# EAGLE design VoltageReferenceProgrammableLTC6655RevDX314 (EAGLE 7.7.0)
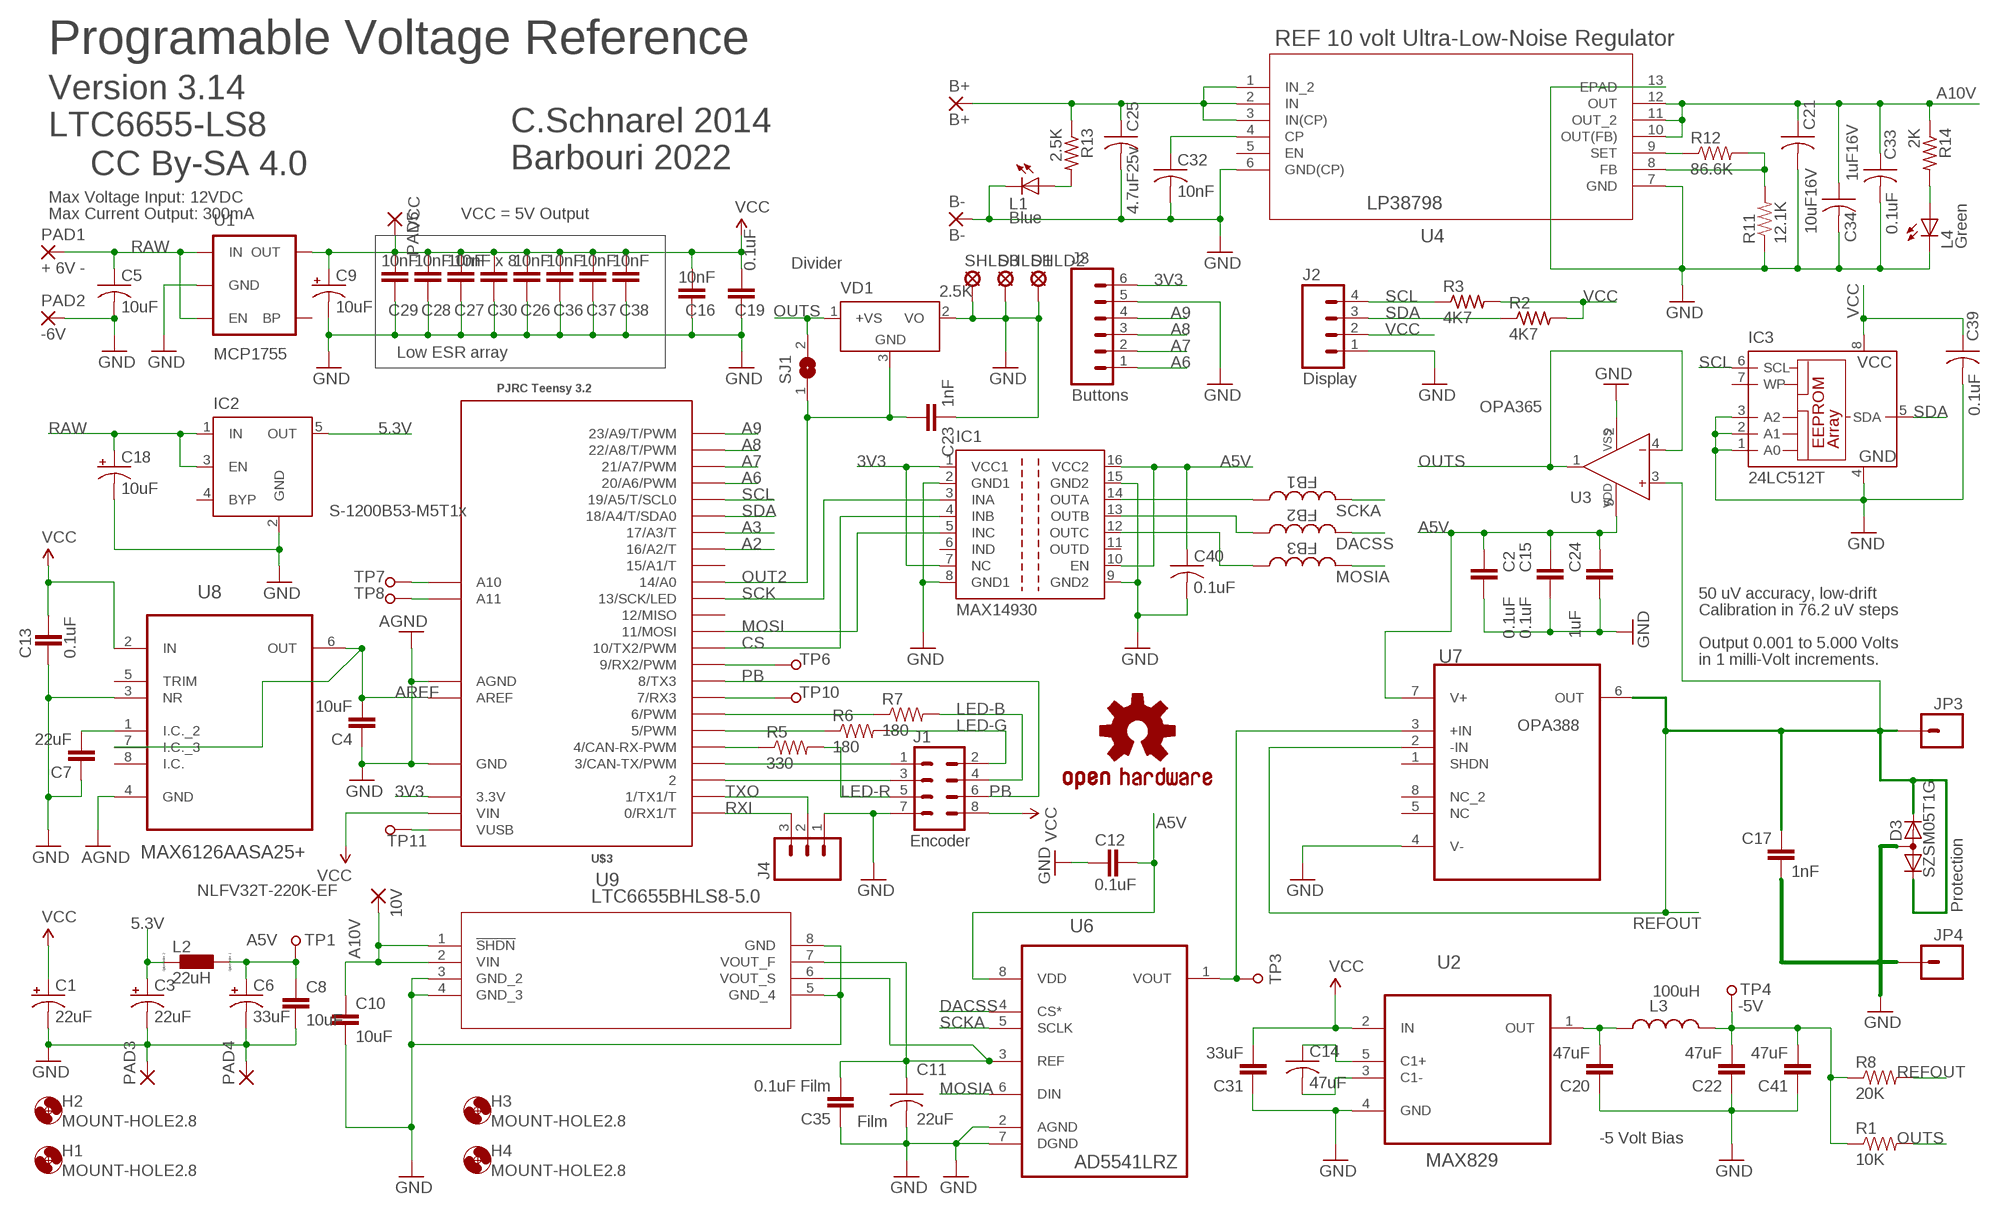
[diagram p0: schematic, sheet 1]

## Parts
10V  1,6/0,9  [1,6/0,9]
B+  B+  1,6/0,9  [1,6/0,9]
B-  B-  1,6/0,9  [1,6/0,9]
C1  22uF  CAP_POL0805  [0805-POL]
C2  0.1uF  CAP0805  [0805]
C3  22uF  CAP_POL0805  [0805-POL]
C4  10uF  CAP0805  [0805]
C5  10uF  C-USC1206K  [C1206K]
C6  33uF  CAP_POL0805  [0805-POL]
C7  22uF  CAP0805  [0805]
C8  10uF  CAP0805  [0805]
C9  10uF  CAP_POL0805  [0805-POL]
C10  10uF  CAP0805  [0805]
C11  22uF  C-USC2220K  [C2220K]
C12  0.1uF  CAP0805  [0805]
C13  0.1uF  CAP0805  [0805]
C14  47uF  C-USC0805  [C0805]
C15  0.1uF  CAP0805  [0805]
C16  10nF  C-EUC0603K  [C0603K]
C17  1nF  CAP0805  [0805]
C18  10uF  CAP_POL0805  [0805-POL]
C19  0.1uF  CAP0805  [0805]
C20  47uF  CAP0805  [0805]
C21  10uF16V  C-USC1206  [C1206]
C22  47uF  CAP1206  [1206]
C23  1nF  CAP0805  [0805]
C24  1uF  CAP0805  [0805]
C25  4.7uF25v  C-USC1206  [C1206]
C26  10nF  C-EUC0603K  [C0603K]
C27  10nF  C-EUC0603K  [C0603K]
C28  10nF  C-EUC0603K  [C0603K]
C29  10nF  C-EUC0603K  [C0603K]
C30  10nF x 8  C-EUC0603K  [C0603K]
C31  33uF  CAP0805  [0805]
C32  10nF  C-USC0805  [C0805]
C33  0.1uF  C-USC0603  [C0603]
C34  1uF16V  C-USC1206  [C1206]
C35  0.1uF Film  CAP0805  [0805]
C36  10nF  C-EUC0603K  [C0603K]
C37  10nF  C-EUC0603K  [C0603K]
C38  10nF  C-EUC0603K  [C0603K]
C39  0.1uF  C-USC0805  [C0805]
C40  0.1uF  C-USC0603  [C0603]
C41  47uF  CAP1206  [1206]
D3  SZSM05T1G  DIODE_CA-AC__  [SOT23C]
FB1  1K  WE-CBA_0402_782422102_WB/HS  [WE-CBA_0402(W=1.5)]
FB2  1K  WE-CBA_0402_782422102_WB/HS  [WE-CBA_0402(W=1.5)]
FB3  1K  WE-CBA_0402_782422102_WB/HS  [WE-CBA_0402(W=1.5)]
H1  MOUNT-HOLE2.8  [2,8]
H2  MOUNT-HOLE2.8  [2,8]
H3  MOUNT-HOLE2.8  [2,8]
H4  MOUNT-HOLE2.8  [2,8]
IC1  MAX14930  ISO7240  [SO-16DW]
IC2  S-1200B53-M5T1x  MIC5219XX  [SOT23-5]
IC3  24LC512T  24LC64SN  [SO-08]
J1  Encoder  M04X2  [2X4]
J2  Display  M04LOCK  [1X04_LOCK]
J3  Buttons  M06LOCK  [1X06_LOCK]
J4  M03LOCK  [1X03_LOCK]
JP3  M01PTH  [1X01]
JP4  M01PTH  [1X01]
L1  Blue  LEDCHIP-LED0603  [CHIP-LED0603]
L2  22uH  LL3225P  [L3225P]
L3  100uH  INDUCTOR0805-IND  [0805]
L4  Green  LEDCHIP-LED0603  [CHIP-LED0603]
LOGO1  OSHW-LOGOM  [OSHW-LOGO-M]
PAD1  + 6V -  2,15/1,0  [2,15/1,0]
PAD2  -6V  2,15/1,0  [2,15/1,0]
PAD3  1,6/0,9  [1,6/0,9]
PAD4  1,6/0,9  [1,6/0,9]
PAD5  1,6/0,9  [1,6/0,9]
R1  10K  RESISTOR0805-RES  [0805]
R2  4K7  R-US_R0603  [R0603]
R3  4K7  R-US_R0603  [R0603]
R5  330  RESISTOR0805-RES  [0805]
R6  180  RESISTOR0805-RES  [0805]
R7  180  RESISTOR0805-RES  [0805]
R8  20K  RESISTOR0805-RES  [0805]
R11  12.1K  RESISTOR0805-RES  [0805]
R12  86.6K  RESISTOR0805-RES  [0805]
R13  2.5K  R-US_R0603  [R0603]
R14  2K  R-US_R0603  [R0603]
SHLD1  SHLD1  LSP11  [LSP11]
SHLD2  SHLD2  LSP11  [LSP11]
SHLD3  SHLD1  LSP11  [LSP11]
SJ1  SJ  [SJ]
TP1  TEST_POINT  [BBD-VIA]
TP3  TEST_POINT  [BBD-VIA]
TP4  TEST_POINT  [BBD-VIA]
TP6  TEST_POINT  [BBD-VIA]
TP7  TEST_POINT  [BBD-VIA]
TP8  TEST_POINT  [BBD-VIA]
TP10  TEST_POINT  [BBD-VIA]
TP11  TEST_POINT  [BBD-VIA]
U1  MCP1755  V_REG_LDOSMD  [SOT23-5]
U2  MAX829  MAX829EUK+T  [SOT95P280X145-5N]
U3  OPA365  [SOT-23-5]
U4  LP38798  LP38798SD-ADJ/NOPB  [DNT12]
U6  AD5541LRZ  [SOIC127P600X175-8N]
U7  OPA388  LTC2050IS8PBF  [SOIC127P600X175-8N]
U8  MAX6126AASA25+  MAX6225ACSA+  [SOIC127P600X175-8N]
U9  LTC6655BHLS8-5.0  LTC6655BHLS8-4.096PBF  [LCC-8_LS8]
U$3  PJRC Teensy 3.2  TEENSY_3.1_DIL+4  [TEENSY3-DIL+4]
VD1  2.5K  LM50  [SOT23]

## Nets
3V3: IC1.1(VCC1) IC1.7(NC) J3.6 U$3.3.3V
5.3V: C3.1(+) IC2.5(OUT) L2.2
9: TP6.P$1 U$3.9(9/RX2/PWM)
-5V: C22.2 C41.2 L3.2 R1.1 R8.1 TP4.P$1
A2: U$3.16/A2(16/A2/T)
A3: U$3.17/A3(17/A3/T)
A5V: C2.1 C6.1(+) C8.1 C12.1 C15.1 C24.1 C40.1 IC1.10(EN) IC1.16(VCC2) L2.1 TP1.P$1 U3.5(VDD) U6.8(VDD) U7.7(V+)
A6: J3.1 U$3.20/A6(20/A6/PWM)
A7: J3.2 U$3.21/A7(21/A7/PWM)
A8: J3.3 U$3.22/A8(22/A8/T/PWM)
A9: J3.4 U$3.23/A9(23/A9/T/PWM)
A10V: 10V.1(P) C10.1 C21.1 C33.1 C34.1 R14.1 U4.10(OUT(FB)) U4.11(OUT_2) U4.12(OUT) U9.1(!SHDN) U9.2(VIN)
AGND: U8.4(GND)
AREF: C4.2 U8.6(OUT) U8.7(I.C._3) U$3.AREF
BATT: B+.1(P) C25.1 R13.1 U4.1(IN_2) U4.2(IN) U4.3(IN(CP))
CS: IC1.4(INB) U$3.10(10/TX2/PWM)
DACSS: FB2.2 U6.4(CS*)
EA: J1.1 U$3.3(3/CAN-TX/PWM)
EB: J1.3 U$3.2
GND [vcc]: B-.1(P) C1.2(-) C2.2 C3.2(-) C4.1 C5.2 C6.2(-) C7.1 C8.2 C9.2(-) C10.2 C11.2 C12.2 C13.2 C15.2 C16.1 C17.1 C18.2(-) C19.1 C20.1 C21.2 C22.1 C23.1 C24.2 C25.2 C26.1 C27.1 C28.1 C29.1 C30.1 C31.1 C32.2 C33.2 C34.2 C35.1 C36.1 C37.1 C38.1 C39.2 C40.2 C41.1 D3.3(A) IC1.2(GND1) IC1.8(GND1) IC1.9(GND2) IC1.15(GND2) IC2.2(GND) IC3.1(A0) IC3.2(A1) IC3.3(A2) IC3.4(GND) J1.7 J2.1 J3.5 J4.1 JP4.1 L1.C L4.C PAD2.1(P) PAD3.1(P) PAD4.1(P) R11.1 SHLD1.MP SHLD2.MP SHLD3.MP U1.2(GND) U2.4(GND) U3.2(VSS) U4.6(GND(CP)) U4.7(GND) U4.13(EPAD) U6.2(AGND) U6.7(DGND) U7.4(V-) U8.3(NR) U9.3(GND_2) U9.4(GND_3) U9.5(GND_4) U9.8(GND) U$3.AGND U$3.GND VD1.2(VO) ; supply symbol labelled AGND
LED-B: J1.4 R7.2
LED-G: J1.2 R6.2
LED-R: J1.5 R5.2
MOSI: IC1.5(INC) U$3.11(11/MOSI)
MOSIA: FB3.2 U6.6(DIN)
N$3: R12.1 U4.9(SET)
N$4: C7.2 U8.1(I.C._2)
N$5: R5.1 U$3.4(4/CAN-RX-PWM)
N$7: R6.1 U$3.5(5/PWM)
N$8: R7.1 U$3.6(6/PWM)
N$12: TP3.P$1 U6.1(VOUT) U7.3(+IN)
N$15: TP7.P$1 U$3.A10
N$16: C20.2 L3.1 U2.1(OUT)
N$17: TP8.P$1 U$3.A11
N$18: R11.2 R12.2 U4.8(FB)
N$19: TP10.P$1 U$3.7(7/RX3)
N$20: TP11.P$1 U$3.VUSB
N$24: C14.2 U2.3(C1-)
N$26: C32.1 U4.4(CP)
N$27: C14.1 U2.5(C1+)
N$31: FB1.1 IC1.14(OUTA)
N$32: L1.A R13.2
N$33: FB2.1 IC1.13(OUTB)
N$34: FB3.1 IC1.12(OUTC)
N$35: L4.A R14.2
OUT2: C23.2 SJ1.1 U$3.14/A0 VD1.3(GND)
OUTS: R1.2 SJ1.2 U3.1(OUT) U3.4(IN-) VD1.1(+VS)
PB: J1.6 U$3.8(8/TX3)
RAW [vcc]: C5.1 C18.1(+) IC2.1(IN) IC2.3(EN) PAD1.1(P) U1.1(IN) U1.3(EN)
REFOUT: C17.2 D3.1(K1) D3.2(K2) JP3.1 R8.2 U3.3(IN+) U7.2(-IN) U7.6(OUT)
RXI: J4.3 U$3.0(0/RX1/T)
SCK: IC1.3(INA) U$3.13(13/SCK/LED)
SCKA: FB1.2 U6.5(SCLK)
SCL: IC3.6(SCL) J2.4 R3.1 U$3.19/A5(19/A5/T/SCL0)
SDA: IC3.5(SDA) J2.3 R2.1 U$3.18/A4(18/A4/T/SDA0)
TXO: J4.2 U$3.1(1/TX1/T)
VCC: C1.1(+) C9.1(+) C13.1 C16.2 C19.2 C26.2 C27.2 C28.2 C29.2 C30.2 C31.2 C36.2 C37.2 C38.2 C39.1 IC3.8(VCC) J1.8 J2.2 PAD5.1(P) R2.2 R3.2 U1.5(OUT) U2.2(IN) U8.2(IN) U$3.VIN
VREF: C11.1 C35.2 U6.3(REF) U9.6(VOUT_S) U9.7(VOUT_F)
Unconnected: IC1.6(IND) IC1.11(OUTD) IC2.4(BYP) IC3.7(WP) U1.4(BP) U4.5(EN) U7.1(SHDN) U7.5(NC) U7.8(NC_2) U8.5(TRIM) U8.8(I.C.) U$3.12(12/MISO) U$3.15/A1(15/A1/T)

## Notes on the sheet
- REF 10 volt Ultra-Low-Noise Regulator
- Programable Voltage Reference
- Version 3.14
  LTC6655-LS8
- C.Schnarel 2014
  Barbouri 2022
- Max Voltage Input: 12VDC
- CC By-SA 4.0
- Max Current Output: 300mA | VCC = 5V Output
- Divider
- Low ESR array
- 50 uV accuracy, low-drift
- Calibration in 76.2 uV steps
- Output 0.001 to 5.000 Volts
- in 1 milli-Volt increments.
- Protection
- -5 Volt Bias

## Library data of the parts
10V B+ B- PAD3-PAD5 = wirepad:1,6/0,9: THROUGH-HOLE PAD
C1 C3 C6 C9 C18 = ChipsParts:CAP_POL
C2 C4 C7 C8 C10 C12 C13 C15 C17 C19 C20 C23 C24 C31 C35 = SparkFun-Capacitors:CAP: Capacitor Standard 0603 ceramic capacitor, and 0.1" leaded capacitor.
C5 C25 C32 C33 C39 C40 = resistor:C-US: CAPACITOR, American symbol
C11 = adafruit:C-US: CAPACITOR, American symbol; DESC: CAP FILM 22UF 20% 16VDC 2220; ESR: Film; MFG: Rubycon; PN: 16MU226MD35750
C14 = adafruit:C-US: CAPACITOR, American symbol
C16 C26-C30 C36-C38 = rcl:C-EU: CAPACITOR, European symbol
C21 = resistor:C-US: CAPACITOR, American symbol; MFG: Kemet; PN: C1206X106K4RACAUTO
C22 C41 = SparkFun-Capacitors:CAP: Capacitor Standard 0603 ceramic capacitor, and 0.1" leaded capacitor.; MFG: Vishay Spraque; PN: T55A107M6R3C0045
C34 = resistor:C-US: CAPACITOR, American symbol; MFG: Kemet; PN: C1206X105K4RACAUTO
D3 = semicon-smd-ipc:DIODE_CA-AC_: DUAL DIODE; DESC: 5V RS 9.8V Clamp 17A Ipp Tvs Diode Surface Mount SOT-23-3; MFG: On Semiconductor; PN: SZSM05T1G
FB1-FB3 = EMCComponents (rev17e):WE-CBA_0402: WE-CBA SMD EMI Suppression Ferrite Bead Characteristics Reliable Ni-Sn electrodes High rated current up to 5A Recommended soldering: Reflow Operating temperature: -55°C to +125°C Applications * Perfect as data line filter and for uncoupling of distribution voltage *This special SMD chip bead ferrites can be put directly on the printed circuit board. They offer excellent anti-EMI properties and low DC-resistance. Placed very close next to the interference source even with smallest size 0402,maximal impedance at 1000 Ω can be reached. *High Speed: "High Speed " SMD ferrites WE-CBF have lower impedance in the lower frequency ranges thus they have only a low attenuation for fast signals. Application e.g. USB 2.0, IEEE 1394,LVDS *Wide Band: "Wide Band" SMD ferrites WE-CBF already show high impedance in low frequency range. Therefore they are wide band through the whole spectrum. Application e.g. control signats, RS232, RS422, DC/DC converter *High Current: "High Current " SMD ferrites WE-CBF are designed for high current (over 1 A). The rated current refers to 40K self-heating. High current SMD ferrites are available in all there types (High Speed, Wide Band and High Frequency). Application e.g. power supply, DC/DC converter *Advice: Pay attention for the use of SMD-Ferrites for high current>1A and ambient temperature over +85°C that the rated current has to be reduced when temperature is above +85°C (Derating). *At+100°C environment temperature the maximal rated current has to add up to only 60% of the data sheet value ,without an overload of the component. Variant abbreviation WB means WIDE BAND HS means HIGH SPEED HC means HIGH CURRENT <http://katalog.we-online.de/media/images/eisos/FeCBA_pf2.jpg> Details see: http://katalog.we-online.de/en/pbs/WE-CBA/ Created: 2015-02-02 2015 (C) Wurth Elektronik; DESC: Ferrite Bead Inductor 1 kOhms @ 100 MHz SMD 0402; MFG: Murata; PN: BLM15HG102SH1D
H1-H4 = holes:MOUNT-HOLE: MOUNTING HOLE with drill center marker
IC1 = texas:ISO7240: HIGH SPEED QUAD DIGITAL ISOLATORS Source: http://focus.ti.com/lit/ds/symlink/iso7240m.pdf; DESC: Digital Isolator 2750Vrms 4 Channel 25Mbps 25kV/µs 16-SOIC-Wide; MFG: Analog Devices Inc./Maxim Integrated; PN: MAX14930EAWE+
IC2 = v-reg-micrel:MIC5219XX: VOLTAGE REGULATOR; DESC: IC REG LINEAR 5.3V 150MA SOT23-5; MFG: ABLIC Inc.; OC_FARNELL: unknown; OC_NEWARK: unknown; PN: S-1200B53-M5T1U
IC3 = microchip:24*: Serial EEPROM I2C; MF: MICROCHIP; MPN: 24LC64-I/SN; OC_FARNELL: 9758070; OC_NEWARK: 12C2020
J1 = SparkFun-Connectors:M04X2: .1" header, two rows of four.
J2 = SparkFun-Connectors:M04: Header 4 Standard 4-pin 0.1" header. Use with straight break away headers (SKU : PRT-00116), right angle break away headers (PRT-00553), swiss pins (PRT-00743), machine pins (PRT-00117), and female headers (PRT-00115). Molex polarized connector foot print use with SKU : PRT-08231 with associated crimp pins and housings. 1MM SMD Version SKU: PRT-10208; PROD_ID: CONN-09696
J3 = SparkFun-Connectors:M06: Header 6 Standard 6-pin 0.1" header. Use with straight break away headers (SKU : PRT-00116), right angle break away headers (PRT-00553), swiss pins (PRT-00743), machine pins (PRT-00117), and female headers (PRT-00115). Molex polarized connector foot print use with SKU : PRT-08094 with associated crimp pins and housings. NOTES ON THE VARIANTS LOCK and LOCK_LONGPADS... This footprint was designed to help hold the alignment of a through-hole component (i.e. 6-pin header) while soldering it into place. You may notice that each hole has been shifted either up or down by 0.005 of an inch from it's more standard position (which is a perfectly straight line). This slight alteration caused the pins (the squares in the middle) to touch the edges of the holes. Because they are alternating, it causes a "brace" to hold the component in place. 0.005 has proven to be the perfect amount of "off-center" position when using our standard breakaway headers. Although looks a little odd when you look at the bare footprint, once you have a header in there, the alteration is very hard to notice. Also,if you push a header all the way into place, it is covered up entirely on the bottom side. This idea of altering the position of holes to aid alignment will be further integrated into the Sparkfun Library for other footprints. It can help hold any component with 3 or more connection pins.
J4 = SparkFun-Connectors:M03: Header 3 Standard 3-pin 0.1" header. Use with straight break away headers (SKU : PRT-00116), right angle break away headers (PRT-00553), swiss pins (PRT-00743), machine pins (PRT-00117), and female headers (PRT-00115). Molex polarized connector foot print use with SKU : PRT-08232 with associated crimp pins and housings.
JP3 JP4 = SparkFun-Connectors:M01: Header 1 Standard 1-pin 0.1" header. Use with straight break away headers (SKU : PRT-00116), right angle break away headers (PRT-00553), swiss pins (PRT-00743), machine pins (PRT-00117), and female headers (PRT-00115). SMTSO-256-ET is a "flush mount" nut for a 4-40 screw. The older package used to be too tight, and did not allow it to sit properly thru the drill hit. The latest (0.165DIA) fits nice and snug.
L1 L4 = led:LED: LED OSRAM: - CHIPLED LG R971, LG N971, LY N971, LG Q971, LY Q971, LO R971, LY R971 LH N974, LH R974 LS Q976, LO Q976, LY Q976 LO Q996 - Hyper CHIPLED LW Q18S LB Q993, LB Q99A, LB R99A - SideLED LS A670, LO A670, LY A670, LG A670, LP A670 LB A673, LV A673, LT A673, LW A673 LH A674 LY A675 LS A676, LA A676, LO A676, LY A676, LW A676 LS A679, LY A679, LG A679 - Hyper Micro SIDELED® LS Y876, LA Y876, LO Y876, LY Y876 LT Y87S - SmartLED LW L88C, LW L88S LB L89C, LB L89S, LG L890 LS L89K, LO L89K, LY L89K LS L896, LA L896, LO L896, LY L896 - TOPLED LS T670, LO T670, LY T670, LG T670, LP T670 LSG T670, LSP T670, LSY T670, LOP T670, LYG T670 LG T671, LOG T671, LSG T671 LB T673, LV T673, LT T673, LW T673 LH T674 LS T676, LA T676, LO T676, LY T676, LB T676, LH T676, LSB T676, LW T676 LB T67C, LV T67C, LT T67C, LS T67K, LO T67K, LY T67K, LW E67C LS E67B, LA E67B, LO E67B, LY E67B, LB E67C, LV E67C, LT E67C LW T67C LS T679, LY T679, LG T679 LS T770, LO T770, LY T770, LG T770, LP T770 LB T773, LV T773, LT T773, LW T773 LH T774 LS E675, LA E675, LY E675, LS T675 LS T776, LA T776, LO T776, LY T776, LB T776 LHGB T686 LT T68C, LB T68C - Hyper Mini TOPLED® LB M676 - Mini TOPLED Santana® LG M470 LS M47K, LO M47K, LY M47K Source: http://www.osram.convergy.de LUXEON: - LUMILED® LXK2-PW12-R00, LXK2-PW12-S00, LXK2-PW14-U00, LXK2-PW14-V00 LXK2-PM12-R00, LXK2-PM12-S00, LXK2-PM14-U00 LXK2-PE12-Q00, LXK2-PE12-R00, LXK2-PE12-S00, LXK2-PE14-T00, LXK2-PE14-U00 LXK2-PB12-K00, LXK2-PB12-L00, LXK2-PB12-M00, LXK2-PB14-N00, LXK2-PB14-P00, LXK2-PB14-Q00 LXK2-PR12-L00, LXK2-PR12-M00, LXK2-PR14-Q00, LXK2-PR14-R00 LXK2-PD12-Q00, LXK2-PD12-R00, LXK2-PD12-S00 LXK2-PH12-R00, LXK2-PH12-S00 LXK2-PL12-P00, LXK2-PL12-Q00, LXK2-PL12-R00 Source: www.luxeon.com KINGBRIGHT: KA-3528ASYC Source: www.kingbright.com
L2 = eagle-ltspice:L: INDUCTOR, European symbol; PN: NLFV32T-220K-EF; SPICEMODEL: NONE; SPICEPREFIX: L
L3 = SparkFun-Passives:INDUCTOR: Inductors Basic Inductor/Choke - 0603 and 1206. Footprints are not proven and vary greatly between part numbers. INDUCTOR POWER 3.3UH 4.0A SMD 0.197" L x 0.197" W x 0.177" H (5.00mm x 5.00mm x 4.50mm); MFG: Taiyo Yuden; PN: ‎LBR2012T101KV‎; PROD_ID: NDUC-13076
LOGO1 = SparkFun-Aesthetics:OSHW-LOGO: Open Source Hardware Logo This logo indicates the piece of hardware it is found on incorporates a OSHW license and/or adheres to the definition of open source hardware found here: http://freedomdefined.org/OSHW
PAD1 PAD2 = wirepad:2,15/1,0: THROUGH-HOLE PAD
R1 R5-R8 R11 R12 = SparkFun-Resistors:RESISTOR: Resistor Basic schematic elements and footprints for 0603, 1206, and PTH resistors.
R2 R3 R13 R14 = adafruit:R-US_: RESISTOR, American symbol
SHLD1-SHLD3 = solpad:LSP11: SOLDER PAD drill 1.1 mm
SJ1 = jumper:SJ: SMD solder JUMPER
TP1 TP3 TP4 TP6-TP8 TP10 TP11 = ChipsParts:TEST_POINT: Test Point
U1 = SparkFun:V_REG_LDO: Voltage Regulator LDO Standard 150mA LDO voltage regulator in SOT-23 layout. Micrel part MIC5205. BP (by-pass) pin is used to lower output noise with 470pF cap.; DESC: IC REG LINEAR 5V 300MA SOT23-5; MFG: Microchip Technology; PN: MCP1755T-5002E/OT
U2 = Maxim_By_element14_Batch_1:MAX829EUK+T: Switched-Capacitor Voltage Inverters; MPN: MAX829EUK+T; OC_FARNELL: 1187966; OC_NEWARK: 67K6767; PACKAGE: SOT-23-5; SUPPLIER: Maxim
U3 = ChipsParts:OPA365: OpAmp, 50MHz, R-to-R, single-supply, CMOS, TI, Digi-Key#296-20645-1-ND; ALTDEVICE: TSV991AILT - ST Micro.; DESC: General Purpose Amplifier 1 Circuit Rail-to-Rail SOT-23-5; MFG: Texas Instruments; PN: OPA365AIDBVR
U4 = LP38798SD:LP38798SD-ADJ/NOPB; BUILT_BY: EMA_UL_Team; MANUFACTURER_PART_NUMBER: LP38798SD-ADJ/NOPB; VENDOR: Texas Instruments
U6 = ADI-Phase-2:AD5541LRZ: 16-Bit Digital-to-Analog Converters; MPN: AD5541LRZ; OC_FARNELL: 1699607; OC_NEWARK: 59K4211; PACKAGE: SOIC-8; SUPPLIER: Analog Devices
U7 = LTC_By_element14_Batch_1:LTC2050IS8PBF: Zero-Drift Operational Amplifi ers; MPN: OPA388; OC_FARNELL: 1627425; OC_NEWARK: 56M4574; PACKAGE: SOIC-8; SUPPLIER: Linear Technology
U8 = Maxim_By_element14_Batch_1:MAX6225ACSA+: Low-Noise, Precision, +2.5V/+4.096V/+5V Voltage References; DESC: Series, Buried Zener Voltage Ref. IC Fixed 2.5V V ±0.04% 15 mA 8-SOIC; MFG: Analog Devices Inc./Maxim Integrated; MPN: MAX6225ACSA+; OC_FARNELL: -; OC_NEWARK: 59J3522; PACKAGE: SOIC-8; PN: MAX6225ACSA+; SUPPLIER: Maxim
U9 = LTC6655BHLS8:LTC6655BHLS8-4.096PBF; DESC: Series Voltage Ref. IC Fixed 5V V ±0.025% 5 mA 8-CLCC; MANUFACTURER_PART_NUMBER: LTC6655BHLS84.096#PBF; VENDOR: Linear Technology
U$3 = Teensy_3_and_LC_Series_Boards_v1.1:TEENSY_3.1_DIL+4: Teensy 3.1 and 3.2 in a DIL package with the inner 4 pins
VD1 = linear:LM50: SOT-23 Single-Supply Centigrade Temperature Sensor Vout = (10mV/°C x Temp °C) +5mmmV Source: http://cache.national.com/ds/LM/LM50.pdf

## Net classes
1 vcc: width 0.254 mm

## Board
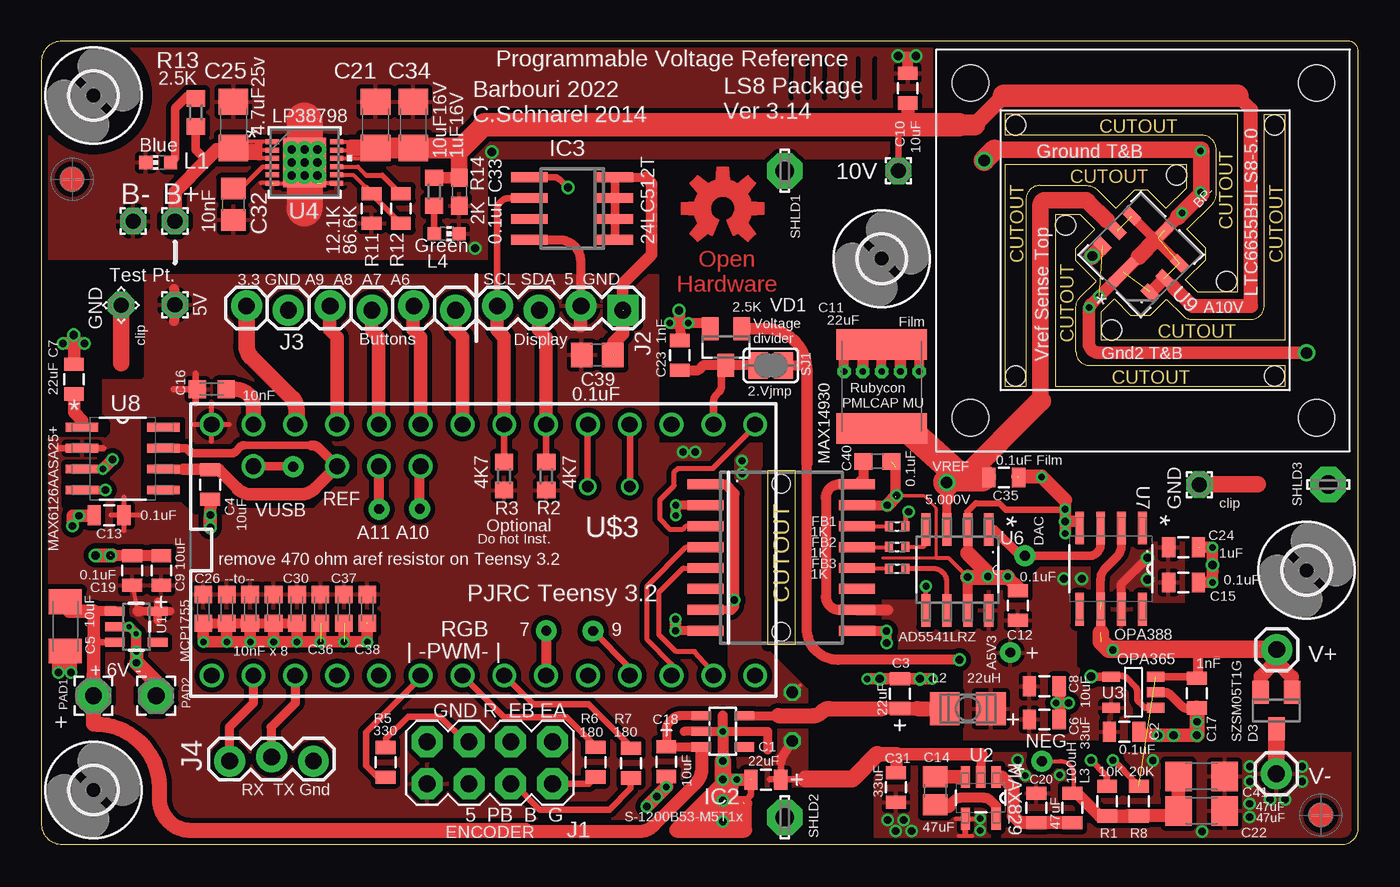
[diagram p1: board, top side]
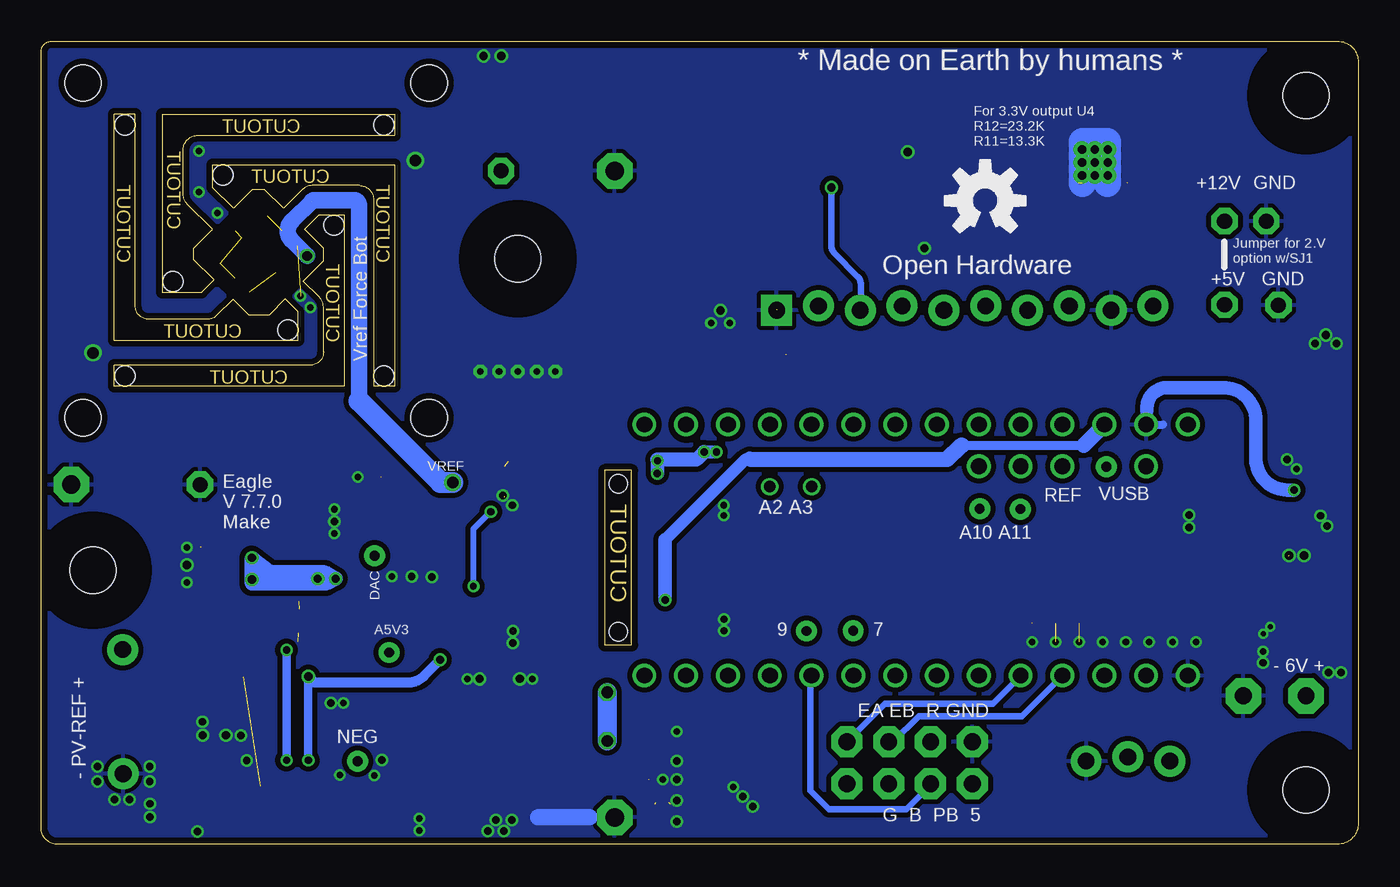
[diagram p2: board, bottom side, seen from below]

Size 80.01 x 48.77 mm. Coordinates in mm from the lower left corner, seen from the top.
Outline: 1.27,0 79.01,0 arc90 80.01,1 80.01,48.13 arc90 79.38,48.77 1.27,48.77 arc90 0,47.5 0,1.27 arc90 1.27,0
Outline: 44.15,22.71 45.78,22.71 45.78,12.12 44.15,12.12 44.15,22.71
Outline: 72.64,44.32 72.64,33.53 70.26,33.53 69.51,34.28 70.74,35.51 70.74,36.2 69.6,37.34 71.14,38.88 arc45 71.37,39.45 71.37,42.19 arc90 70.51,43.05 58.55,43.05 58.55,44.32 72.64,44.32
Outline: 63.12,38.23 61.59,38.23 61.59,27.81 75.56,27.81 75.56,29.08 63.68,29.08 arc-90 62.87,29.9 62.87,32.63 arc-45 63.1,33.21 64.1,34.2 62.87,35.43 62.87,36.2 64.01,37.34 63.12,38.23
Outline: 75.56,30.61 64.39,30.61 64.39,32.33 65.18,33.12 66.17,32.13 67.37,32.13 68.35,33.11 69.34,32.12 arc45 69.92,31.88 73.48,31.88 arc90 74.3,32.69 74.3,44.32 75.56,44.32 75.56,30.61
Outline: 69.6,39.88 69.6,41.27 58.55,41.27 58.55,27.81 59.82,27.81 59.82,39.14 arc-90 60.68,40.01 63.54,40.01 arc-45 64.12,39.77 65.28,38.61 66.42,39.75 67.18,39.75 68.33,38.61 69.6,39.88
Copper layers (1*16): Top 0.0356mm / dielectric 1.5011mm / Bottom 0.0356mm
Design rules "LaenPCBOrder *": minimum track width 8mil, minimum drill 10mil, track to track 12mil, track to pad 12mil, pad to pad 12mil, via to via 12mil, smd to smd 6mil, copper to edge 15mil, drill to drill 8mil, minimum pad ring 6mil, minimum via ring 6mil, stop-mask expansion 4mil, vias tented up to drill 0.505459375mm, thermal gap 10mil
Holes 1.1 mm at 44.96,21.89 44.96,12.9
Holes 1.2 mm at 62.23,37.59 74.93,28.45 59.18,43.69 72.01,34.16 74.93,43.69 65.02,31.24 59.18,28.45 68.96,40.64
Holes 2.2 mm at 77.47,25.91 77.47,46.23 56.44,46.23 56.44,25.91
tRestrict: area 39.9,24.5 to 41.8,26.4; 76 lines
bRestrict: area 39.9,24.5 to 41.8,26.4; area 63,32.8 to 69.8,39.6

### Footprints (pad centres in the part's own frame; a part is rotated, then mirrored left to right if it is on the bottom)
1,6/0,9 = drill 0.914 pad 1.6 octagon: 1 0,0
0805-POL = smd 0.8 x 1.2: 1 -0.9,0; 2 0.9,0
0805 = smd 0.8 x 1.2: 1 -0.9,0; 2 0.9,0
C1206K = smd 1.5 x 2: 1 -1.5,0; 2 1.5,0
C2220K = smd 1.85 x 5.5: 1 -2.55,0; 2 2.55,0
C0805 = smd 1.3 x 1.5: 1 -0.85,0; 2 0.85,0
C0603K = smd 1.05 x 1.08: 1 -0.875,0; 2 0.875,0
C1206 = smd 1.6 x 1.8: 1 -1.4,0; 2 1.4,0
1206 = smd 1.6 x 1.8: 1 -1.4,0; 2 1.4,0
C0805' = smd 1.3 x 1.5: 1 -0.95,0; 2 0.95,0
C0603 = smd 1.1 x 1: 1 -0.85,0; 2 0.85,0
SOT23C = smd 1 x 1.4: 1 -0.95,-1.1; 2 0.95,-1.1; 3 0,1.1
WE-CBA_0402(W=1.5) = smd 0.5 x 0.6: 1 -0.5,0; 2 0.5,0
2,8 = hole 2.8: 0,0
SO-16DW = smd 0.6 x 2.2: 1 -4.445,-4.6; 2 -3.175,-4.6; 3 -1.905,-4.6; 4 -0.635,-4.6; 5 0.635,-4.6; 6 1.905,-4.6; 7 3.175,-4.6; 8 4.445,-4.6; 9 4.445,4.6; 10 3.175,4.6; 11 1.905,4.6; 12 0.635,4.6; 13 -0.635,4.6; 14 -1.905,4.6; 15 -3.175,4.6; 16 -4.445,4.6
SOT23-5 = smd 0.55 x 1.2: 1 -0.95,-1.3; 2 0,-1.3; 3 0.95,-1.3; 4 0.95,1.3; 5 -0.95,1.3
SO-08 = smd 0.6 x 2.2: 1 -1.905,-2.6; 2 -0.635,-2.6; 3 0.635,-2.6; 4 1.905,-2.6; 5 1.905,2.6; 6 0.635,2.6; 7 -0.635,2.6; 8 -1.905,2.6
2X4 = drill 1.016 pad 1.88 octagon: 1 -3.81,-1.27; 2 -3.81,1.27; 3 -1.27,-1.27; 4 -1.27,1.27; 5 1.27,-1.27; 6 1.27,1.27; 7 3.81,-1.27; 8 3.81,1.27
1X04_LOCK = drill 1.016 pad 1.88 square: 1 0,0.127 | drill 1.016 pad 1.88: 2 2.54,-0.127; 3 5.08,0.127; 4 7.62,-0.127
1X06_LOCK = drill 1.016 pad 1.88: 1 0,0; 2 2.54,-0.254; 3 5.08,0; 4 7.62,-0.254; 5 10.16,0; 6 12.7,-0.254
1X03_LOCK = drill 1.016 pad 1.88: 1 0,0.127; 2 2.54,-0.127; 3 5.08,0.127
1X01 = drill 1.016 pad 1.88: 1 0,0
CHIP-LED0603 = smd 0.8 x 0.8: A 0,-0.75; C 0,0.75
L3225P = smd 1.8 x 2: 1 -1.4,0; 2 1.4,0
2,15/1,0 = drill 1.016 pad 2.159 octagon: 1 0,0
R0603 = smd 1 x 1.1: 1 -0.85,0; 2 0.85,0
LSP11 = drill 1.118 pad 2.159 octagon: MP 0,0
SJ = smd 1.168 x 1.6: 1 -0.762,0; 2 0.762,0
BBD-VIA = drill 0.6 pad 1.27: P$1 0,0
SOT95P280X145-5N = smd 1.321 x 0.559: 1 -1.27,0.94; 2 -1.27,0; 3 -1.27,-0.94; 4 1.27,-0.94; 5 1.27,0.94
SOT-23-5 = smd 0.6 x 1.05: 1 -0.95,-1.35; 2 0,-1.35; 3 0.95,-1.35; 4 0.95,1.35; 5 -0.95,1.35
DNT12 = smd 0.805 x 0.3: 1 -1.952,1.25; 2 -1.952,0.75; 3 -1.952,0.25; 4 -1.952,-0.25; 5 -1.952,-0.75; 6 -1.952,-1.25; 7 1.952,-1.25; 8 1.952,-0.75; 9 1.952,-0.25; 10 1.952,0.25; 11 1.952,0.75; 12 1.952,1.25 | smd 2.6 x 3: 13 0,0 | drill 0.508 pad 1.016: V -0.787,-0.787; V_1 -0.787,0; V_2 -0.787,0.787; V_3 0,-0.787; V_4 0,0; V_5 0,0.787; V_6 0.787,-0.787; V_7 0.787,0; V_8 0.787,0.787
SOIC127P600X175-8N = smd 1.981 x 0.559: 1 -2.464,1.905; 2 -2.464,0.635; 3 -2.464,-0.635; 4 -2.464,-1.905; 5 2.464,-1.905; 6 2.464,-0.635; 7 2.464,0.635; 8 2.464,1.905
SOIC127P600X175-8N' = smd 1.981 x 0.533: 1 -2.464,1.905; 2 -2.464,0.635; 3 -2.464,-0.635; 4 -2.464,-1.905; 5 2.464,-1.905; 6 2.464,-0.635; 7 2.464,0.635; 8 2.464,1.905
LCC-8_LS8 = smd 0.635 x 2.007: 1 0,1.524 | smd 0.991 x 0.635: 2 -2.032,1.27; 3 -2.032,0; 4 -2.032,-1.27; 6 2.032,-1.27; 7 2.032,0; 8 2.032,1.27 | smd 0.635 x 0.991: 5 0,-2.032
TEENSY3-DIL+4 = drill 0.965: 0 -7.62,13.97; 1 -7.62,11.43; 2 -7.62,8.89; 3 -7.62,6.35; 3.3V 7.62,11.43; 4 -7.62,3.81; 5 -7.62,1.27; 6 -7.62,-1.27; 7 -7.62,-3.81; 8 -7.62,-6.35; 9 -7.62,-8.89; 10 -7.62,-11.43; 11 -7.62,-13.97; 12 -7.62,-16.51; 13 7.62,-16.51; 14/A0 7.62,-13.97; 15/A1 7.62,-11.43; 16/A2 7.62,-8.89; 17/A3 7.62,-6.35; 18/A4 7.62,-3.81; 19/A5 7.62,-1.27; 20/A6 7.62,1.27; 21/A7 7.62,3.81; 22/A8 7.62,6.35; 23/A9 7.62,8.89; A10 5.08,6.35; A11 5.08,3.81; AGND 7.62,13.97; AREF 5.08,8.89; GND -7.62,16.51; VIN 7.62,16.51; VUSB 5.08,13.97
SOT23 = smd 1 x 1.4: 1 -0.95,-1.1; 2 0.95,-1.1; 3 0,1.1

### Placement (x,y rotation side)
10V  52.07,40.89 0 top
B+  8.13,37.85 0 top
B-  5.59,37.85 0 top
C1  44.02,3.92 180 top
C2  65.79,6.83 0 top
C3  52.16,9.14 90 top
C4  10.26,21.84 90 top
C5  1.47,13.23 270 top
C6  60.93,7.58 0 top
C7  1.99,28.24 270 top
C8  60.93,9.6 0 top
C9  7.3,16.62 90 top
C10  52.64,45.91 90 top
C11  51.05,27.81 90 top
C12  59.33,14.5 90 top
C13  4.13,19.98 180 top
C14  54.31,3.25 90 top
C15  69.38,15.9 0 top
C16  10.36,27.64 180 top
C17  70.19,9.18 90 top
C18  37.97,5.02 270 top
C19  5.54,16.62 270 top
C20  60.45,2.21 270 top
C21  20.32,43.69 90 top
C22  70.48,2.03 180 top
C23  38.79,29.69 270 top
C24  69.38,18.03 0 top
C25  11.68,43.69 90 top
C26  9.86,14.3 90 top
C27  11.28,14.3 90 top
C28  12.7,14.3 90 top
C29  14.12,14.3 90 top
C30  15.54,14.3 90 top
C31  51.92,3.45 90 top
C32  10nF  [C0805']  11.68,38.86 270 top
C33  25.4,39.62 270 top
C34  22.61,43.69 90 top
C35  58.47,22.28 180 top
C36  16.97,14.3 90 top
C37  18.39,14.3 90 top
C38  19.81,14.3 90 top
C39  0.1uF  [C0805']  33.78,29.72 0 top
C40  50.8,23.24 0 top
C41  70.48,4.13 180 top
D3  75.03,8.13 180 top
FB1  51.99,19.3 0 top
FB2  51.99,18.06 0 top
FB3  51.99,16.74 0 top
FID1  1  [FIDUCIAL_G15]  1.88,40.39 0 top
FID2  2  [FIDUCIAL_G15]  77.72,1.78 0 top
H1  76.86,16.64 0 top
H2  3.17,3.3 0 top
H3  3.17,45.47 0 top
H4  51.05,35.56 0 top
IC1  44.96,17.41 270 top
IC2  41.4,6.86 270 top
IC3  32.26,38.61 90 top
J1  27.25,4.95 180 top
J2  35.33,32.56 180 top
J3  25.17,32.44 180 top
J4  16.54,5.18 180 top
JP3  75.06,11.82 0 top
JP4  75.03,4.28 0 top
L1  7.11,41.4 90 top
L2  56.29,8.24 180 top
L3  62.64,2.21 90 top
L4  24.64,37.08 270 top
LOGO1  22.67,39.09 0 bottom
PAD1  3.17,9.02 0 top
PAD2  6.99,9.02 0 top
PAD3  4.85,32.74 315 top
PAD4  70.36,21.84 0 top
PAD5  8.13,32.77 0 top
R1  64.74,2.62 90 top
R2  30.68,22.35 270 top
R3  28.12,22.35 270 top
R5  20.93,4.98 90 top
R6  33.68,4.99 270 top
R7  35.83,4.93 270 top
R8  66.67,2.62 90 top
R11  20.07,38.61 90 top
R12  21.84,38.61 270 top
R13  9.4,44.45 90 top
R14  23.88,39.62 270 top
SHLD1  45.17,40.89 90 top
SHLD2  45.17,1.64 90 top
SHLD3  78.18,21.84 0 top
SJ1  44.32,29.08 0 top
TP1  58.86,11.65 0 top
TP3  59.77,17.53 0 top
TP4  60.78,5.05 0 top
TP6  33.53,12.95 0 top
TP7  20.54,20.36 0 top
TP8  23,20.37 0 top
TP10  30.68,12.97 0 top
TP11  15.32,22.94 0 top
U1  5.78,13.21 270 top
U2  57.07,2.82 270 top
U3  66.34,9.23 90 top
U4  16,41.4 0 top
U6  55.65,16.66 270 top
U7  OPA388  [SOIC127P600X175-8N']  64.99,16.74 270 top
U8  MAX6126AASA25+  [SOIC127P600X175-8N']  4.95,23.42 0 top
U9  66.8,35.81 135 top
U$1  [OSHW-LOGO-M_COPPER]  41.4,38.61 0 top
U$3  26.86,17.87 90 top
VD1  41.59,30.2 180 top

### Tracks (layer width: path | path; a pad name or v marks a point on that pad's centre or on a via)
3V3  (via drill 0.45)
  Top 0.254: 15.51,25.41 15.43,25.67 U$3.3.3V
  Top 0.508: 41.57,21.86 IC1.1 | IC1.7 41.92,14.24 | 42.13,14.87 v42.09,14.83 42.11,14.81
  Top 0.61: 42.13,14.87 42.13,21.3 41.57,21.86 | 41.92,14.24 42.11,14.43 42.11,14.81
  Top 1.016: J3.6 12.47,30.27 arc45 12.76,29.57 15.21,27.11 arc-45 15.51,26.41 15.51,25.41
  Bottom 0.254: 15.42,25.46 15.43,25.46 U$3.3.3V
  Bottom 0.533: 24.11,24.22 16.68,24.22
  Bottom 0.61: v42.09,14.83 42.11,14.83 42.1,14.85
  Bottom 0.711: 42.1,18.5 37.22,23.38 37.19,23.39 36.98,23.39
  Bottom 0.813: 42.1,14.85 42.1,18.5
  Bottom 0.914: 36.98,23.39 24.98,23.39 | 16.68,24.22 15.42,25.46
  Bottom 0.965: 24.98,23.39 24.11,24.22
5.3V
  Top 0.406: C3.1 52.12,8.26
  Top 0.559: IC2.5 43.11,7.81 44.77,7.81
  Top 0.787: 52.12,8.26 51.07,8.26
  Top 0.813: C3.1 53.21,8.24
  Top 0.864: 51.07,8.26 51.1,8.24
  Top 0.914: 53.21,8.24 L2.2 | 51.1,8.24 47.88,8.24 arc45 47.43,8.06 47.37,8 arc-45 46.92,7.81 44.77,7.81
9
  Top 0.406: U$3.9 35.75,10.73 TP6.P$1
-5V
  Top 0.254: TP4.P$1 61.9,5.05 arc-90 62.71,4.24 62.71,3.52 | 62.71,3.52 L3.2 | 62.71,3.52 62.71,3.19 62.61,3.11 | 64.5,1.7 R1.1
  Top 0.61: 62.61,3.11 62.91,3.11
  Top 0.711: 65.92,1.73 R8.1 | 64.31,1.7 64.5,1.7
  Top 0.762: 62.91,3.11 64.31,1.7
  Top 0.787: 68.74,1.74 68.63,1.73 65.92,1.73
  Top 0.8: C22.2 68.74,1.74
  Top 0.813: R1.1 R8.1 | C41.2 C22.2
A2  (via drill 0.7)
  Top 0.406: v35.76,21.72 35.76,25.48 U$3.16/A2
A3  (via drill 0.7)
  Top 0.406: v33.2,21.72 33.2,25.4 33.15,25.53 33.19,25.49 U$3.17/A3
A5V  (via drill 0.5)
  Top 0.406: 49.53,14.24 IC1.10
  Top 0.533: 65.62,13.61 65.62,15.81 v67.21,17.4
  Top 0.61: 49.53,14.24 48.48,14.24 arc-90 47.66,15.05 47.66,21.04 arc-90 48.48,21.86 IC1.16 49.95,22.25 C40.1
  Top 0.66: IC1.10 51.42,14.24
  Bottom 0.254: v67.21,16.08 66.75,16.08 66.75,16.13
  Bottom 0.813: 66.75,16 66.75,16.13 66.75,16.59
  Bottom 0.864: v62.12,16.13 v62.13,16.13 | v62.13,16.13 65.91,16.13 67.06,17.27 v67.21,17.4 | v62.13,16.13 62.71,15.82 67.21,15.82 v67.21,16.08 v67.21,17.4 | v62.13,16.13 62.76,16.51 66.06,16.51 v67.21,17.4
  other vias: 63.21,16.13
  pour Top: 51.18,18.29 69.85,18.29 69.98,6.4 51.18,6.4
A6
  Top 0.406: U$3.20/A6 25.64,25.49
  Top 0.813: U$3.20/A6 25.59,30.8 25.15,31.24 25.15,32.41 J3.1
A7
  Top 0.406: U$3.21/A7 23.06,25.49
  Top 0.813: U$3.21/A7 23.05,30.8 22.61,31.24 22.61,32.66 J3.2
A8
  Top 0.813: U$3.22/A8 20.51,30.8 20.07,31.24 20.07,32.41 J3.3
A9
  Top 0.813: U$3.23/A9 17.97,30.8 17.53,31.24 17.53,32.66 J3.4
A10V  (1 unrouted)
  Top 0.254: U4.12 18.8,42.65 | U4.10 19.68,41.65 | U4.11 18.78,42.15 | 18.8,42.67 18.8,42.65 | 18.8,42.65 18.8,41.66 18.67,41.66 18.67,42.55 18.69,42.55 18.8,42.65
  Top 0.305: 18.8,42.65 19.96,42.65 C21.1 20.18,42.15 19.68,41.65 | 18.78,42.15 18.92,42.16
  Top 0.406: 10V.1 52.07,43.69
  Top 0.559: U9.2 67.34,33.56 | 68.33,34.29 67.44,33.4
  Top 0.61: 68.2,34.42 68.33,34.29 68.76,33.86
  Top 0.635: 67.34,33.56 68.2,34.42
  Top 0.711: R14.1 C33.1
  Top 0.762: 18.92,42.16 20.18,42.15
  Top 0.813: C10.1 52.64,43.62 55.75,43.69 | 73.48,44.63 72.64,45.47
  Top 0.864: 68.76,33.86 69.93,32.69 73.48,32.7 73.48,44.63
  Top 0.965: 56.71,43.69 58.48,45.47
  Top 1.016: C33.1 25.4,42.29
  Top 1.27: C21.1 C34.1 25.4,42.29 25.52,42.29 26.92,43.69 | 55.75,43.69 56.71,43.69
  Top 1.372: 58.48,45.47 72.64,45.47
  Top 1.422: 26.92,43.69 52.07,43.69 55.75,43.69
AGND  (via drill 0.45)
  Top 0.152: v3.91,21.51 3.76,21.51
  Top 0.254: 3.05,21.51 U8.4
  Top 0.508: 3.05,21.51 3.76,21.51
  Bottom 0.813: v3.91,21.51 4.32,21.51 arc90 6.22,23.42 6.22,25.74 arc-90 8.22,27.74 11.58,27.74 arc-90 12.85,26.47 12.85,26.31
AREF
  Top 0.406: C4.2 10.77,22.74
  Top 0.457: 12.32,24.23 16.43,24.23
  Top 0.508: 10.22,22.78 C4.2 | U8.7 8.71,24.05 arc-45 8.93,23.96 9.05,23.84 arc45 9.28,23.75 11.58,23.75 arc45 11.8,23.84 12.1,24.14 arc-45 12.32,24.23
  Top 0.533: U8.6 8.64,22.78
  Top 0.61: 16.43,24.23 arc-45 16.87,24.05 U$3.AREF
  Top 0.711: 8.64,22.78 10.22,22.78
  Top 0.762: 10.77,22.74 11.9,21.62 arc45 12.79,21.25 15.74,21.25 arc45 16.64,21.62 U$3.AREF
BATT
  Top 0.254: U4.1 12.05,42.65 | U4.3 12.32,41.65 | U4.2 13.35,42.15 13.34,42.16 | 13.21,42.65 13.21,41.66 13.34,41.66 13.34,42.16 | 13.34,42.16 13.34,42.55
  Top 0.305: 12.05,42.65 C25.1 11.82,42.15 12.32,41.65 | 13.35,42.15 13.08,42.16
  Top 0.508: R13.1 9.4,42.16 10.03,41.53
  Top 0.762: 13.08,42.16 11.82,42.15
  Top 0.813: B+.1 8.13,39.62 10.03,41.53 10.67,42.16 11.56,42.16 C25.1
CS
  Top 0.254: 40.34,18.06 IC1.4
  Top 0.305: U$3.10 38.3,10.95 36.8,12.45 36.8,15.68 39.18,18.06 40.34,18.06
DACSS
  Top 0.254: FB2.2 53.59,18.06 53.75,18.21 U6.4
EA
  Bottom 0.406: J1.1 31.06,6.24 28.75,8.55 22.21,8.55 U$3.3
EB
  Bottom 0.406: J1.3 28.26,6.22 26.7,7.79 20.43,7.79 U$3.2
GND  (via drill 0.3, 0.4, 0.4 pad 0.69, 0.4 pad 0.81, 0.45, 0.45 pad 0.69, 0.5, 0.5 pad 0.69, 0.7)  (21 unrouted)
  Top 0.152: 17.78,40.13 17.93,40.13 U4.7
  Top 0.178: 51.1,17.4 54.38,17.4 54.38,20.28 arc45 54.29,20.5 53.62,21.16
  Top 0.203: 53.62,21.16 51.94,21.16
  Top 0.229: 55.73,0.51 56.08,0.51 | 56.08,0.51 56.54,0.51 | 56.13,0.99 56.11,0.99 56.11,1.55 56.08,1.55 56.08,0.51
  Top 0.254: U$3.AGND 12.88,25.5 | C30.1 15.52,13.44 | 54.38,17.4 55.12,17.4 v56.29,16.23 | 5.79,12.78 v5.78,12.78 | U4.6 14.75,40.15 | 17.78,40.13 17.02,40.13 | 36.83,2.35 v36.78,2.29 | 62.23,20.22 62.23,19.58 v62.2,19.61 | U4.6 13.34,40.16 | 51.27,20.5 v51.4,20.59 51.28,20.57 51.27,20.5
  Top 0.279: 55.58,1.55 56.11,1.55
  Top 0.305: 51.35,12.97 v51.35,12.95 | 70.14,8.27 C17.1 | 63.12,19.51 63.12,18.78 U7.4 | C19.1 C9.2 | C13.2 2.59,19.98 v2.3,19.95 | 56.11,1.55 56.67,1.55 | 14.75,40.15 U4.13 | 62.13,20.32 62.23,20.22
  Top 0.356: 56.13,0.61 56.13,0.99 | 56.77,20.7 58.22,20.7 58.6,20.32
  Top 0.406: C4.1 10.29,20.79 | 56.26,19.81 56.26,20.19 56.77,20.7 | 58.6,20.32 62.13,20.32 | 43.12,3.94 43.12,3.12 arc-45 43.02,2.89 42.67,2.54
  Top 0.457: 63.02,19.61 63.12,19.51
  Top 0.508: U8.3 v3.76,22.78 | IC3.4 IC3.3 IC3.2 IC3.1
  Top 0.559: U1.2 v5.36,13.21 | IC1.8 v38.53,12.97 | IC1.2 v38.56,20.59 | U3.2 68.22,9.23 arc-45 68.58,9.08 69.24,8.42 arc45 69.6,8.27 70.14,8.27 | U6.2 56.29,17.68 | 39.05,6.86 IC2.2 v41.4,6.86 44.12,6.86 44.12,5.71 | IC3.4 36.7,40.51
  Top 0.584: 5.38,13.21 5.79,12.78
  Top 0.597: IC1.9 51.35,12.97
  Top 0.61: C5.2 1.08,11.32 1.8,11.63 | IC1.15 v51.4,20.59 | 51.88,21.07 51.94,21.16 | VD1.2 40.36,31.64 v39.32,31.65 | 66.76,6.63 C2.2 | v38.19,31.65 38.76,31.65 38.81,31.65 38.82,30.63 C23.1 | 9.88,13.44 15.52,13.44 | v62.42,8.59 61.87,8.48 | 61.87,8.48 61.87,7.59 C6.2 | 61.87,8.48 61.87,9.61 C8.2 | U6.7 v56.29,16.23 | 59.33,15.6 59.32,15.6 C12.2 | v51.05,28.7 C11.2 | v48.77,28.7 48.77,29.46 | v53.34,28.7 53.34,29.46 | v52.06,47.87 52.64,47.85 C10.2 | 52.6,47.71 52.6,46.81 52.51,46.8 | v41.4,6.86 41.4,7.81 | v51.36,12.95 51.36,12.32
  Top 0.635: v5.78,11.02 v5.78,12.78 | 51.88,22.92 51.88,21.14
  Top 0.66: C9.2 4.24,17.53 | v41.4,6.86 v41.4,5.08
  Top 0.686: v62.2,19.61 63.02,19.61 | v38.53,13.66 v38.53,12.98
  Top 0.711: C15.2 v71.14,15.9 | C3.2 50.32,10.04 v54.13,10.05 | 38.25,31.65 38.76,31.65 | 38.76,31.65 v39.32,31.65 | v11.28,12.29 v15.54,12.29 | v11.28,12.29 v9.86,12.29 C26.1 | v15.54,12.29 C30.1 | C27.1 v11.28,12.29 | C28.1 v12.7,12.29 v14.12,12.29 C29.1 | v2.3,19.95 2.36,19.93 | v4.34,23.37 3.79,22.81 | v71.14,15.9 v71.14,18.03 70.36,18.03 | v71.16,16.97 v71.14,15.9 | v49.91,28.7 49.91,29.46 | v52.2,28.7 52.2,29.46 | 37.97,3.49 C18.2 | 36.7,40.51 37.08,40.13 37.08,35.81 35.31,34.04 35.31,32.51 35.31,32.46 | v62.2,18.87 v62.2,20.34 62.2,20.9 | 19.81,13.46 v19.81,12.29 v15.54,12.29 | v38.76,32.41 38.76,31.65
  Top 0.762: 1.8,11.63 v1.8,10.43 | C1.2 v41.4,3.92 | v1.33,30.42 1.91,30.42 | 1.91,30.42 v2.63,30.42 | C7.1 1.99,30.32 1.91,30.42 | 10.29,20.79 v10.27,19.99 | 69.09,38.1 67.82,36.83 | 3.15,19.94 1.91,19.94 1.91,19.3 | v1.04,10.44 1.04,11.1
  Top 0.813: 51.94,21.16 v51.4,20.59 | v70.21,6.63 66.76,6.63 | 5.79,11.63 5.79,11.02 | 6.99,9.83 PAD2.1 | 58.7,16.23 59.33,15.6 | 10.27,19.95 v10.27,19.23 | 36.83,2.35 37.97,3.49 | 35.31,32.51 35.31,30.99 34.8,30.48 34.8,29.72
  Top 0.864: 57.51,16.46 v57.51,16.27 57.38,16.38 | 62.2,20.9 60.78,22.33 59.36,22.33 | v3.3,17.54 4.33,17.54
  Top 0.914: C17.1 v70.21,6.63 | C16.1 11.81,27.64 arc-90 12.88,26.57 12.88,25.5 | 5.79,11.02 6.99,9.83 | v56.29,16.23 58.7,16.23 | 56.29,17.68 57.51,16.46 | 41.4,3.81 41.4,3.05 39.22,0.86 | 39.22,0.86 42.72,0.86 42.72,2.46 41.81,2.46 40.74,1.4 42.11,1.4 42.11,1.78 | 41.3,3.56 38.61,0.86 39.22,0.86 | 41.91,2.54 41.91,3.56
  Top 1.016: JP4.1 75.03,5.99 75.02,6.45 D3.3 | PAD3.1 4.85,29.21 | v41.4,5.08 v41.4,3.92 | 69.09,38.1 70.48,39.5 70.48,42.16 57.91,42.16
  Top 1.27: 57.91,42.16 v57.28,41.53
  Top 2.184: 16,43.94 16,38.61
  Bottom 0.483: U$3.AGND 11.86,25.49
  Bottom 0.61: 12.89,26.24 U$3.AGND
  Bottom 1.016: 49.84,1.64 46.71,1.64
  Bottom 1.676: 15.24,40.13 15.24,42.67 16.76,42.67 16.76,40.13
  other vias: 42.24,3.92 70.21,7.44 5.78,11.7 4.2,17.54 51.36,12.23 51.96,21.17 38.56,19.98 50.94,10.05 67.87,6.62 68.78,6.62 59.31,5.12 57.05,1.57 73.39,2.46 73.39,1.65 70.52,0.79 67.53,5.08 74.65,2.73 59.77,4.18 16.97,12.29 57.05,0.84 51.42,1.47 52.39,1.47 61.87,4.2 18.39,12.29 1.91,19.32 1.98,30.92 61.66,8.59 58.7,16.26 51.9,0.81 76.59,4.72 75.55,2.72 76.59,3.81 52.87,0.81 50.16,10.05 53.38,10.05 70.43,42.09 53.14,47.87 70.43,39.61 37.4,2.91 37.97,3.48 27.38,42.04 69.29,38.34 41.4,2.65 41.4,1.38 73.42,4.72 73.42,3.81 76.86,29.84 63.65,32.6 64.26,33.29 60.78,22.3 26.37,36.2
  pour Top: 50.67,0.03 79.91,0.04 79.91,5.46 50.67,5.46
  pour Bottom: 0.05,0 80.01,0 80.01,48.77 0.05,48.77
  pour Top: 0,35.56 27.05,35.56 27.05,41.66 54.1,41.66 54.1,48.77 0,48.77
GND1
  Top 1.016: 70.38,21.87 73.91,21.87
LED-B
  Top 0.406: J1.4 28.71,3.68 30.29,2.11 34.53,2.11 35.81,3.39 35.81,4.01 R7.2
LED-G
  Top 0.406: J1.2 33.27,3.68 R6.2
LED-R
  Top 0.406: J1.5 25.77,6.22 24.24,7.75 22.29,7.75 20.94,6.43 R5.2
MOSI
  Top 0.254: U$3.11 40.83,10.43
  Top 0.305: 40.83,10.43 39.69,11.7 38.57,11.7 37.53,12.74 37.53,15.3 38.99,16.76 40.34,16.76 IC1.5
MOSIA
  Top 0.305: U6.6 55.02,15.93 arc90 54.2,16.74 FB3.2
N$1  (via drill 0.45)
  Top 0.406: v65.1,5.11 65.15,5.11 66.45,3.81 66.45,3.4
  Bottom 0.508: v65.1,5.11 65.1,11.76
N$2  (via drill 0.45)
  other vias: 65.1,11.8
N$3
  Top 0.254: U4.9 19.22,41.15 19.74,40.64
  Top 0.305: 19.74,40.64 20.71,40.64 R12.1
N$4
  Top 0.508: 2.49,25.73 U8.1
  Top 0.762: C7.2 1.99,26.23 2.49,25.73
N$5
  Top 0.406: U$3.4 23.05,10.12 19.74,6.81 19.74,4.78 20.37,4.14 20.92,4.14 R5.1
N$7
  Top 0.406: R6.1 33.68,5.94 31.91,7.71 28.13,7.71 U$3.5
N$8
  Top 0.406: R7.1 35.73,6.01 33.26,8.5 29.91,8.5 U$3.6
N$11
  Top 1.016: 64.36,12.85 64.36,12.29
N$12
  Top 0.508: U7.3 64.35,18.18 arc-46 64.16,17.72 64.14,17.7 arc-44 63.7,17.53 TP3.P$1 | U6.1 57.87,19.1
  Top 0.61: 57.87,19.1 59.47,17.53 TP3.P$1
N$15
  Top 0.406: 20.54,22.92 U$3.A10
  Top 0.61: TP7.P$1 20.54,22.92
N$16
  Top 0.508: 58.34,4.09 U2.1
  Top 0.762: 59.05,1.73 59.05,3.38 58.34,4.09
  Top 0.787: L3.1 C20.2 59.47,1.31 59.05,1.73
N$17
  Top 0.406: 23,22.9 U$3.A11
  Top 0.61: TP8.P$1 23,22.9
N$18
  Top 0.254: U4.8 18.94,40.65 19.76,39.83
  Top 0.305: 19.68,39.87 19.88,39.5 20.08,39.5 R11.2 20.07,39.49 R12.2
  Top 0.406: 19.76,39.83 19.68,39.87
N$19
  Top 0.406: 30.68,10.26 U$3.7
  Top 0.61: TP10.P$1 30.68,10.26
N$20
  Top 0.406: 15.3,22.95 TP11.P$1
  Top 0.508: U$3.VUSB 15.3,22.95
N$21
  Top 0.711: 63.88,35.81 63.83,35.69
  Top 1.016: 63.83,35.69 64.33,36.18
N$23
  Top 0.61: 66.55,37.85 69.09,35.31
N$24
  Top 0.508: 55.96,4.09 U2.3
  Top 0.762: 55.83,4.1 55.96,4.09
  Top 0.813: C14.2 55.83,4.1
N$26
  Top 0.279: U4.4 13.47,41.15 12.19,39.88
  Top 0.305: 12.19,39.88 11.75,39.88 C32.1
N$27
  Top 0.559: U2.5 58.01,2.31
  Top 0.61: 58.01,2.31 57.65,2.67 arc45 57.3,2.82 55.81,2.82 arc45 55.45,2.67 55.12,2.34
  Top 0.66: 54.4,2.34 C14.1
  Top 0.864: 55.12,2.34 54.4,2.34
N$29
  Top 0.61: 38.56,20.04 38.56,20.57
N$31
  Top 0.254: IC1.14 51.4,19.32 FB1.1
N$32
  Top 0.508: L1.A 7.87,41.4 8.13,41.66 8.13,44.7 8.89,45.47 9.06,45.47 R13.2
N$33
  Top 0.254: IC1.13 51.37,18.05 FB2.1
N$34
  Top 0.254: IC1.12 51.4,16.78 FB3.1
N$35
  Top 0.406: R14.2 23.88,37.1 L4.A
N$37
  Top 0.711: 16.97,13.44 16.97,12.5
N$38
  Top 0.711: 18.39,13.44 18.39,12.5
N$39
  Top 0.762: 66.67,35.69 65.15,34.16 63.81,32.83 arc45 63.63,32.38 63.63,30.48 arc90 64.26,29.84 76.83,29.84
  Top 1.016: 66.67,35.69 67.69,36.7
OUT2
  Top 0.305: 41.34,28.82 VD1.3
  Top 0.406: VD1.3
  Top 0.457: U$3.14/A0 40.84,26.87 arc-45 41.03,27.31 41.15,27.44 arc45 41.34,27.89 41.34,28.82
  Top 0.61: C23.2 39.92,28.79 40.23,29.11 VD1.3 | SJ1.1 41.59,29.08 VD1.3
OUTS  (via drill 0.45, 0.5)
  Top 0.305: 64.65,10.22 U3.4 64.61,10.19
  Top 0.406: U3.1 67.17,8.28 arc-45 66.95,8.38 66.68,8.64 arc-45 66.59,8.87 66.59,9.25 arc45 66.44,9.61 65.97,10.07 arc45 65.61,10.22 64.65,10.22 | 42.56,31.32 VD1.1 | R1.2 64.75,4.01 arc45 64.65,4.23 v63.78,5.11
  Top 0.508: v63.78,10.19 64.61,10.19
  Top 0.61: v55.78,11.2 48.41,11.2 arc-90 46.51,13.11 46.51,23.14 | SJ1.2 46.51,29.08 46.51,28.78
  Top 0.711: 46.51,23.14 46.51,28.78 arc90 43.97,31.32 42.56,31.32
  Bottom 0.508: v63.78,5.11 v63.78,10.19
  Bottom 0.61: v63.78,10.19 63.42,9.83 57.68,9.83 arc-45 56.78,10.2 v55.78,11.2
PB
  Bottom 0.406: J1.6 25.91,3.68 27.46,2.13 32.14,2.13 33.27,3.26 33.27,9.75 33.24,9.79 33.24,10.22 U$3.8
RAW
  Top 0.254: 3.17,7.3 3.3,7.3
  Top 0.406: U1.3 3.19,12.26 3.2,12.5
  Top 0.559: 40.13,5.59 40.13,5.88 IC2.3 37.98,5.91 C18.1 37.97,6.98 arc-45 38.16,7.42 38.36,7.62 arc-45 38.8,7.81 IC2.1
  Top 0.61: U1.1 2.96,14.16 3.2,14.15
  Top 0.762: 3.2,12.5 3.2,14.15 | 29.44,0.85 29.46,0.79
  Top 0.775: 29.46,0.79 36.33,0.79 arc45 37.23,1.16 39.76,3.69 arc45 40.13,4.59 40.13,5.59
  Top 0.813: PAD1.1 3.17,10.29 3.2,9.8 3.2,12.5 | 3.2,14.15 1.7,14.15 C5.1
  Top 0.914: 3.3,7.3 arc-90 7.18,3.43 7.18,2.76 arc90 9.08,0.85 29.44,0.85 | PAD1.1 3.17,7.3
REFOUT  (3 unrouted)
  Top 0.305: 69.98,10.18 C17.2
  Top 0.406: U7.6 64.35,13.8
  Top 0.457: U3.3 69.98,10.18
  Top 0.508: U7.2 65.62,18.15 arc-45 65.33,17.45 64.64,16.75 arc45 64.35,16.05 U7.6
  Top 0.559: 64.36,14.76 64.36,12.85
  Top 0.61: 70.27,11.84 70.27,10.29 C17.2
  Top 0.813: JP3.1 75.01,11.25 75.26,10.87 75.2,10.96 74.73,10.83
  Top 0.864: JP3.1 74.32,11.84 | D3.1 75.97,10.15 75.26,10.87 | D3.2 74.08,10.19 74.73,10.83 | 64.4,12.29 64.43,12.19
  Top 1.067: 74.32,11.84 70.27,11.84 64.85,11.84 64.4,12.29
RXI
  Top 0.559: U$3.0 12.89,8.57 11.43,7.11 11.43,6.86 J4.3
SCK
  Top 0.254: 43.32,25.36 U$3.13
  Top 0.305: IC1.3 39.14,19.3 38.95,19.11 38.23,19.11 37.58,19.77 37.58,20.92 38.44,21.78 38.44,22.62 38.67,22.84 40.82,22.84 43.32,25.36
SCKA  (via drill 0.4, 0.45)
  Top 0.305: U6.5 v53.75,15.67 | v52.7,20.19 52.5,19.96 FB1.2
  Bottom 0.356: v53.75,15.67 53.75,19.15 v52.7,20.19
SCL
  Top 0.406: IC3.6 28.45,39.24 arc90 27.69,38.48 27.69,32.72 | R3.1 28.12,25.48 U$3.19/A5
  Top 0.508: 27.69,32.72 J2.4
  Top 0.813: U$3.19/A5 28.13,30.8 27.69,31.24 27.69,32.66 J2.4
SDA  (via drill 0.5)
  Top 0.406: IC3.5 31.11,40.51 arc-45 31.55,40.33 v32,39.88 | R2.1 30.68,25.48 U$3.18/A4
  Top 0.813: U$3.18/A4 30.67,30.8 30.23,31.24 30.23,32.41 J2.3
  Bottom 0.406: v32,39.88 32,36.33 arc-45 31.82,35.88 30.41,34.48 arc45 30.23,34.03 30.23,32.46
  Bottom 0.508: 30.23,32.46 J2.3
TXO
  Top 0.559: U$3.1 15.43,8.57 13.97,7.11 J4.2
VCC  (via drill 0.45, 0.7)
  Top 0.254: 5.86,14.16 5.6,15.66 C19.2 5.54,15.73 | v45.63,9.23 46.1,9.65
  Top 0.305: 9.27,25.5 11.43,25.5 | 10.34,26.57 10.34,24.46 | 5.03,21.08 5.03,19.05 | 5.97,19.99 4.24,19.99
  Top 0.406: 46.46,3.96 44.26,3.96 | 45.15,3.95 C1.1 | 3.76,24.05 1.04,24.05 | 44.93,4.98 44.92,3.72 | 8.05,27.64 9.75,27.64 | 9.4,28.57 9.4,26.77
  Top 0.508: 5.98,14.15 U1.5 | 7.82,14.16 U1.5 | U1.5 6.01,14.16 | 7.09,13.6 7.1,14.73 | 32.77,32.77 32.77,32.72 J2.2
  Top 0.559: U2.2 57.1,5.46 | v45.63,6.29 44.96,5.26 44.93,4.98 | IC3.8 31.5,36.7 arc-90 32.77,35.43 32.77,32.77
  Top 0.61: 6.01,14.16 5.98,14.15 5.87,14.15 5.86,14.16 | 8.08,33.73 8.08,31.77
  Top 0.762: 57.1,5.46 51.94,5.46 51.94,4.35
  Top 0.813: C31.2 51.94,4.35 | 32.77,32.77 32.77,31.5
  Top 0.889: 51.94,5.46 50.77,5.46
  Top 1.041: 50.77,5.46 49.28,3.96 46.46,3.96
  Bottom 0.254: v39.73,23.82 39.75,23.81 | 42.58,23.3 42.47,23.32
  Bottom 0.305: v38.99,23.82 39,23.81
  Bottom 0.61: v42.57,23.29 42.47,23.32 42.42,23.29 v42.57,23.29 | v42.57,23.29 42.58,23.3
  Bottom 0.762: 42.58,23.36 v42.57,23.29
  Bottom 0.787: 39,23.81 39.73,23.81
  Bottom 0.813: 42.58,23.3 v42.58,22.52
  Bottom 0.864: 39.75,23.81 40.21,23.36 42.58,23.36
  Bottom 1.168: v45.63,9.23 v45.63,6.29
  pour Top: 0.05,0 46.51,0 46.51,9.41 43.75,12.17 43.75,24.32 37.47,24.32 37.47,34.54 0.3,34.54
VREF  (via drill 0.6, 0.7)  (2 unrouted)
  Top 0.406: 52.73,25.12 51.2,24.87 C11.1
  Top 0.559: U6.3 55.02,20.95 55.02,21.36 | v55.02,21.97 55.52,22.58
  Top 0.61: 55.04,22.1 55.52,22.58 | v55.02,21.97 55.02,21.36
  Top 0.635: U9.7 64.73,37.89
  Top 0.813: C35.2 57.15,22.28
  Top 0.864: v55.02,21.97 55.02,20.95
  Top 1.016: 64.73,37.89 63.59,39.02 arc45 63.37,39.12 61.02,39.12 arc90 60.71,38.8 60.71,26.92
  Top 1.27: 60.71,26.92 55.83,22.05
  Top 1.676: 55.52,22.58 52.73,25.12 | 55.32,22.28 v55.02,21.97
  Top 1.727: 57.15,22.28 55.32,22.28
  Bottom 0.914: 64.79,37.82 64.72,37.9
  Bottom 1.016: v63.84,35.73 64.79,36.67 arc90 64.79,37.82 | 64.72,37.9 63.59,39.02 arc45 63.37,39.12 61.02,39.12 arc90 60.71,38.8 60.71,26.92
  Bottom 1.27: 60.71,26.92 55.75,21.97 v55.02,21.97

### Text on the board
Top: Open / Hardware
Dimension: CUTOUT | CUTOUT | CUTOUT | CUTOUT | CUTOUT | CUTOUT | CUTOUT | CUTOUT | CUTOUT
tNames: Programmable Voltage Reference | LS8 Package | Barbouri 2022 / C.Schnarel 2014 | Ver 3.14 | Ground T&B | BP- | GND | Test Pt. | 3.3 GND A9 A8 A7 A6 | SCL SDA 5 GND | 5V | . | clip | A10V | Film | Voltage / divider | Vref Sense Top | Gnd2 T&B | 2.Vjmp | PMLCAP MU | Rubycon | VREF | GND | . | REF | 5.000V | VUSB | Optional | clip | A11 A10 | Do not Inst. | remove 470 ohm aref resistor on Teensy 3.2 | . | DAC | . | --to-- | RGB | 7 | 9 | | -PWM- | | A5V3 | + | V+ | GND R EB EA | + | NEG | RX TX Gnd | V- | 5 PB B G | ENCODER
bNames: * Made on Earth by humans * | For 3.3V output U4 / R12=23.2K / R11=13.3K | +12V | GND | +5V | Jumper for 2.V / option w/SJ1 | Open Hardware | GND | Vref Force Bot | VREF | VUSB | REF | A2 A3 | A10 A11 | Eagle / V 7.7.0 / Make | DAC | 7 | 9 | A5V3 | - 6V + | EA EB R GND | NEG | - PV-REF + | G B PB 5